# EAGLE design chandelier (EAGLE 6.4)
DATABASE: ../../control-surface/pcb/partsdb.txt
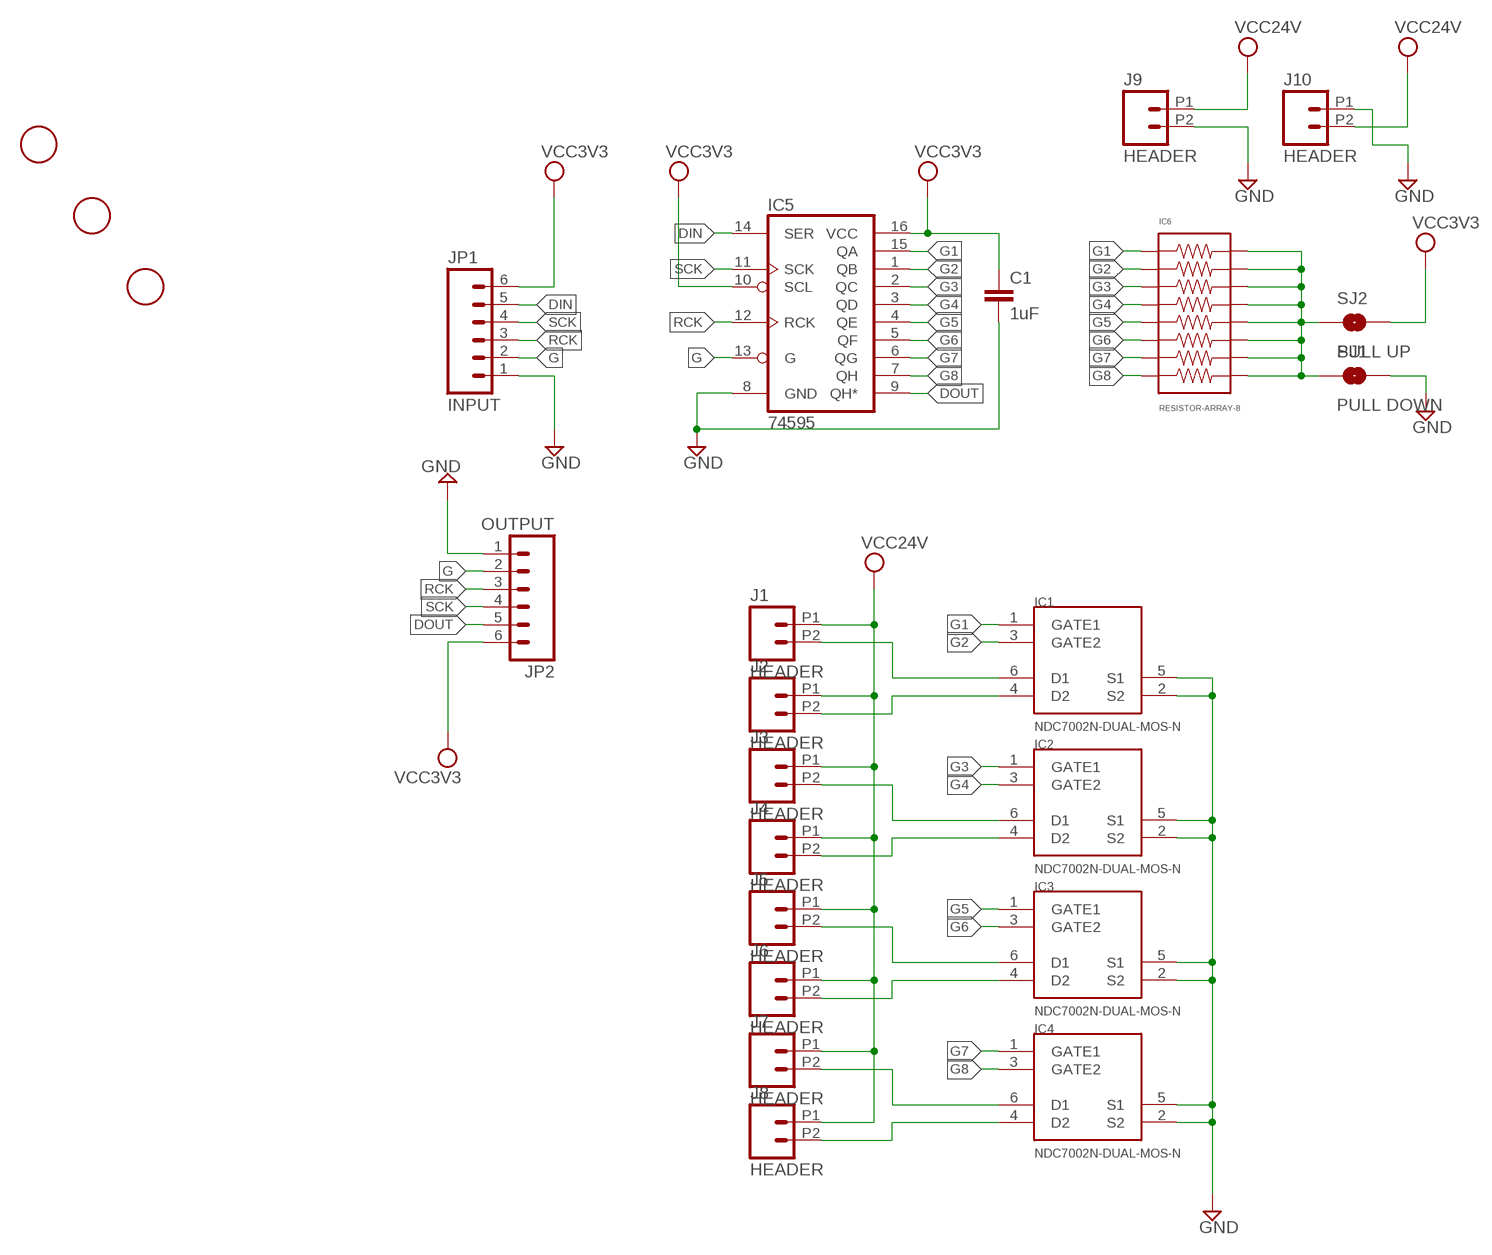
[diagram p0: schematic, sheet 1]

## Parts
C1  1uF  CAP0805  [0805]
IC1  NDC7002N-DUAL-MOS-N  [SSOT6]
IC2  NDC7002N-DUAL-MOS-N  [SSOT6]
IC3  NDC7002N-DUAL-MOS-N  [SSOT6]
IC4  NDC7002N-DUAL-MOS-N  [SSOT6]
IC5  74595  [TSSOP16]
IC6  RESISTOR-ARRAY-8  [CAY16-103J8]
J1  HEADER  [1X02-5.08-SCREWTERM]
J2  HEADER  [1X02-5.08-SCREWTERM]
J3  HEADER  [1X02-5.08-SCREWTERM]
J4  HEADER  [1X02-5.08-SCREWTERM]
J5  HEADER  [1X02-5.08-SCREWTERM]
J6  HEADER  [1X02-5.08-SCREWTERM]
J7  HEADER  [1X02-5.08-SCREWTERM]
J8  HEADER  [1X02-5.08-SCREWTERM]
J9  HEADER  [1X02-5.08-SCREWTERM]
J10  HEADER  [1X02-5.08-SCREWTERM]
JP1  INPUT  M06SIP_LOCK  [1X06-SIP_LOCK]
JP2  OUTPUT  M06SIP_LOCK  [1X06-SIP_LOCK]
SJ1  PULL DOWN  SOLDERJUMPERTRACE  [SJ_2S-TRACE]
SJ2  PULL UP  SOLDERJUMPERNO  [SJ_2S-NO]
U$1  FIDUCIAL  [FIDUCIAL_1MM]
U$4  FIDUCIAL  [FIDUCIAL_1MM]
U$5  FIDUCIAL  [FIDUCIAL_1MM]

## Nets
DIN: IC5.14(SER) JP1.5
DOUT: IC5.9(QH*) JP2.5
G: IC5.13(G) JP1.2 JP2.2
G1: IC1.1(GATE1) IC5.15(QA) IC6.2
G2: IC1.3(GATE2) IC5.1(QB) IC6.4
G3: IC2.1(GATE1) IC5.2(QC) IC6.6
G4: IC2.3(GATE2) IC5.3(QD) IC6.8
G5: IC3.1(GATE1) IC5.4(QE) IC6.10
G6: IC3.3(GATE2) IC5.5(QF) IC6.12
G7: IC4.1(GATE1) IC5.6(QG) IC6.14
G8: IC4.3(GATE2) IC5.7(QH) IC6.16
GND [power]: C1.2 IC1.2(S2) IC1.5(S1) IC2.2(S2) IC2.5(S1) IC3.2(S2) IC3.5(S1) IC4.2(S2) IC4.5(S1) IC5.8(GND) J9.P2 J10.P1 JP1.1 JP2.1 SJ1.2
N$1 [power]: IC1.6(D1) J1.P2
N$2 [power]: IC1.4(D2) J2.P2
N$3 [power]: IC2.6(D1) J3.P2
N$4 [power]: IC2.4(D2) J4.P2
N$5 [power]: IC3.6(D1) J5.P2
N$6 [power]: IC3.4(D2) J6.P2
N$7 [power]: IC4.6(D1) J7.P2
N$8 [power]: IC4.4(D2) J8.P2
N$9: IC6.1 IC6.3 IC6.5 IC6.7 IC6.9 IC6.11 IC6.13 IC6.15 SJ1.1 SJ2.1
RCK: IC5.12(RCK) JP1.3 JP2.3
SCK: IC5.11(SCK) JP1.4 JP2.4
VCC3V3: C1.1 IC5.10(SCL) IC5.16(VCC) JP1.6 JP2.6 SJ2.2
VCC24V [power]: J1.P1 J2.P1 J3.P1 J4.P1 J5.P1 J6.P1 J7.P1 J8.P1 J9.P1 J10.P2

## Library data of the parts
C1 = SparkFun-Capacitors:CAP: Capacitor Standard 0603 ceramic capacitor, and 0.1" leaded capacitor.; PARTNO: CL21B105KOFNNNE
IC1-IC4 = Livestream:NDC7002N-DUAL-MOS-N; PARTNO: NDC7002N
IC5 = SparkFun-DigitalIC:74*595: 8-bit SHIFT REGISTER, output latch; PARTNO: 74VHC595MTCX
IC6 = Livestream:RESISTOR-ARRAY-8; PARTNO: CAY16-103J8LF
J1-J10 = Livestream:HEADER
JP1 JP2 = SparkFun-Connectors:M06: Header 6 Standard 6-pin 0.1" header. Use with straight break away headers (SKU : PRT-00116), right angle break away headers (PRT-00553), swiss pins (PRT-00743), machine pins (PRT-00117), and female headers (PRT-00115). Molex polarized connector foot print use with SKU : PRT-08094 with associated crimp pins and housings. NOTES ON THE VARIANTS LOCK and LOCK_LONGPADS... This footprint was designed to help hold the alignment of a through-hole component (i.e. 6-pin header) while soldering it into place. You may notice that each hole has been shifted either up or down by 0.005 of an inch from it's more standard position (which is a perfectly straight line). This slight alteration caused the pins (the squares in the middle) to touch the edges of the holes. Because they are alternating, it causes a "brace" to hold the component in place. 0.005 has proven to be the perfect amount of "off-center" position when using our standard breakaway headers. Although looks a little odd when you look at the bare footprint, once you have a header in there, the alteration is very hard to notice. Also,if you push a header all the way into place, it is covered up entirely on the bottom side. This idea of altering the position of holes to aid alignment will be further integrated into the Sparkfun Library for other footprints. It can help hold any component with 3 or more connection pins.
SJ1 SJ2 = SparkFun-Passives:SOLDERJUMPER: Solder Jumper Standard SMD solder jumper. Used to automate production. Two varients : Normally Open and Normally Closed are the same, but have different paste layers. NC will have a large amount of paste and should jumper during reflow.
U$1 U$4 U$5 = adafruit:FIDUCIAL: For use by pick and place machines to calibrate the vision/machine, 1mm By microbuilder.eu

## Net classes
0 default: width 0.152 mm, drill 0.381 mm, clearance 0.152 mm
1 power: width 0.254 mm, drill 0.381 mm, clearance 0.152 mm

## Board
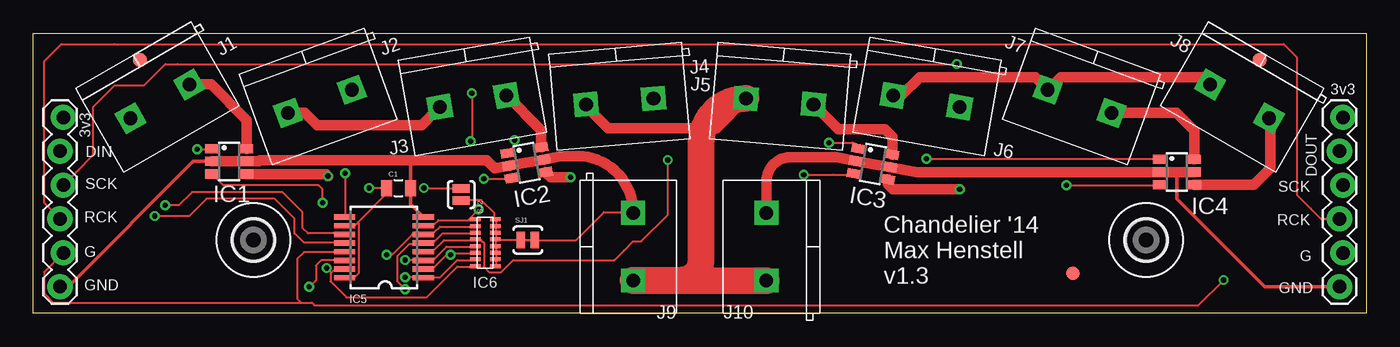
[diagram p1: board, top side]
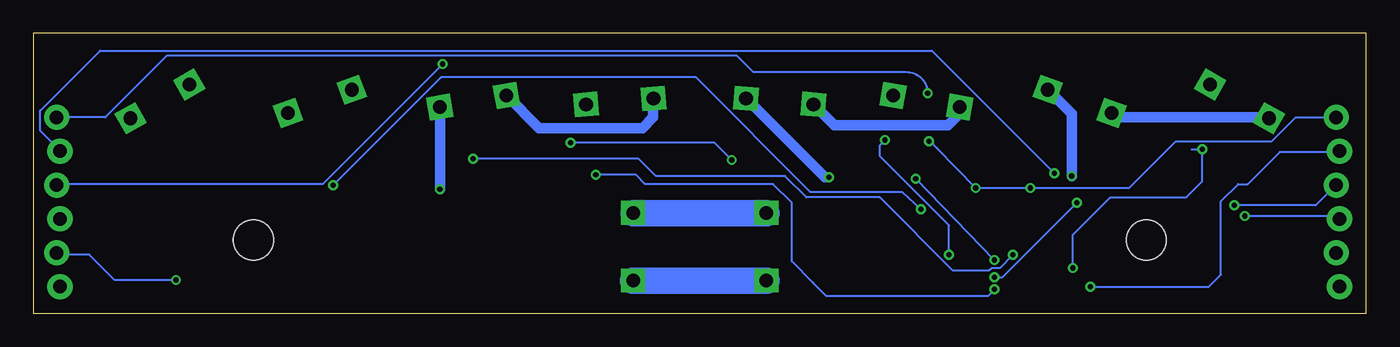
[diagram p2: board, bottom side, seen from below]

Size 100 x 21 mm. Coordinates in mm from the lower left corner, seen from the top.
Outline: 100,21 100,0 0,0 0,21 100,21
Copper layers (1*16): Top 0.0356mm / dielectric 1.5011mm / Bottom 0.0356mm
Design rules "oshpark *": minimum track width 6mil, minimum drill 13mil, track to track 6mil, track to pad 6mil, pad to pad 6mil, via to via 6mil, smd to smd 6mil, copper to edge 15mil, drill to drill 6mil, minimum pad ring 7mil, minimum via ring 7mil, stop-mask expansion 3mil, vias tented up to drill 15mil, thermal gap 10mil

### Footprints (pad centres in the part's own frame; a part is rotated, then mirrored left to right if it is on the bottom)
0805 = smd 0.8 x 1.2: 1 -0.9,0; 2 0.9,0
SSOT6 = smd 0.69 x 0.99: 1 -0.95,-1.3; 2 0,-1.3; 3 0.95,-1.3; 4 0.95,1.3; 5 0,1.3; 6 -0.95,1.3
TSSOP16 = smd 0.4 x 1.6: 1 -2.225,-2.85; 2 -1.575,-2.85; 3 -0.925,-2.85; 4 -0.275,-2.85; 5 0.375,-2.85; 6 1.025,-2.85; 7 1.675,-2.85; 8 2.325,-2.85; 9 2.325,3.05; 10 1.675,3.05; 11 1.025,3.05; 12 0.375,3.05; 13 -0.275,3.05; 14 -0.925,3.05; 15 -1.575,3.05; 16 -2.225,3.05
CAY16-103J8 = smd 0.3 x 0.8: 1 -1.75,-0.75; 2 -1.75,0.75; 3 -1.25,-0.75; 4 -1.25,0.75; 5 -0.75,-0.75; 6 -0.75,0.75; 7 -0.25,-0.75; 8 -0.25,0.75; 9 0.25,-0.75; 10 0.25,0.75; 11 0.75,-0.75; 12 0.75,0.75; 13 1.25,-0.75; 14 1.25,0.75; 15 1.75,-0.75; 16 1.75,0.75
1X02-5.08-SCREWTERM = drill 1.016 pad 1.778 square: P1 -2.54,0; P2 2.54,0
1X06-SIP_LOCK = drill 1.016 pad 1.88: 1 0,0; 2 2.54,-0.254; 3 5.08,0; 4 7.62,-0.254; 5 10.16,0; 6 12.7,-0.254
SJ_2S-TRACE = smd 0.635 x 1.27: 1 -0.508,0; 2 0.508,0
SJ_2S-NO = smd 0.635 x 1.27: 1 -0.45,0; 2 0.45,0
FIDUCIAL_1MM = smd 1 x 1: 1 0,0
HOLE-3 = hole 3: 0,0

### Placement (x,y rotation side)
C1  27.4,9.4 0 top
IC1  14.7,11.4 270 top
IC2  37,11.3 280 top
IC3  63,11.2 260 top
IC4  85.8,10.6 270 top
IC5  26.4,4.9 90 top
IC6  33.9,5.3 90 top
J1  9.5,15.9 30 top
J2  21.5,15.9 20 top
J3  33,15.9 10 top
J4  44,15.9 5 top
J5  56,15.9 355 top
J6  67,15.9 350 top
J7  78.5,15.9 340 top
J8  90.5,15.9 330 top
J9  45,5 90 top
J10  55,5 270 top
JP1  2,2 90 top
JP2  98,2 90 top
SJ1  37.1,5.5 0 top
SJ2  32.1,8.9 90 top
U$1  8,19 0 top
U$2  [HOLE-3]  83.5,5.5 0 top
U$3  [HOLE-3]  16.5,5.5 0 top
U$4  92,19 0 top
U$5  78,3 0 top

### Tracks (layer width: path | path; a pad name or v marks a point on that pad's centre or on a via)
DIN  (via drill 0.38)
  Top 0.152: IC5.14 23.3,4 21.6,4 21.2,3.6 21.2,2.5 v20.7,2
  Bottom 0.152: JP1.5 2,12.1 6.5,12.1 8.9,9.7 9.6,9.7 10.9,8.4 10.9,2.9 11.8,2 v20.7,2
DOUT  (via drill 0.38)
  Top 0.152: v23.4,10.5 23.4,7.3 IC5.9
  Bottom 0.152: v23.4,10.5 32.6,19.7 95,19.7 99.5,15.2 99.5,13.7 98,12.2 JP2.5
G  (via drill 0.38)
  Top 0.152: 20.1,0.8 1.5,0.8 0.8,1.5 0.8,3.1 2.2,4.5 JP1.2 | 20.1,0.8 20.9,0.8 21.1,0.6 36.3,0.6 87.4,0.6 v89.3,2.5 | IC5.13 23.3,4.6 20.3,4.6 19.8,4.1 19.8,1.1 20.1,0.8
  Bottom 0.152: 98.2,4.5 JP2.2 98.11,4.4 95.8,4.4 93.9,2.5 v89.3,2.5
G1  (via drill 0.38)
  Top 0.152: 22.35,3.05 22.6,3.3 23.3,3.3 IC5.15 | 22.35,3.05 22.3,3 22.3,2.4 23.5,1.2 29.5,1.2 31.8,3.5 33.1,3.5 IC6.2 | v12.3,12.3 13.4,12.3 IC1.1 | 22.35,3.05 v22,3.4
  Bottom 0.152: 13.1,12.3 v12.3,12.3 12.3,9.9 13.5,8.7 19.2,8.7 22,5.9 v22,3.4
G2  (via drill 0.38)
  Top 0.152: IC6.4 33.1,4 31.8,4 30.5,2.7 29.3,2.7 IC5.1 29.2,2.7 v27.9,2.7 | 13.4,10.4 IC1.3 14.25,9.6 21.4,9.6 21.7,9.3 v21.7,8.3
  Bottom 0.152: v21.7,8.3 27.3,2.7 v27.9,2.7
G3  (via drill 0.38)
  Top 0.152: 31.3,4.5 31.1,4.5 30,3.4 29.3,3.4 IC5.2 | 31.3,4.5 33.1,4.5 IC6.6 | 31.3,4.5 v31.3,4.4 | 35.6,12 IC2.1 36.1,12.55 v36.1,13
  Bottom 0.152: v31.3,4.4 31.3,6.6 36.5,11.8 36.5,12.6 v36.1,13
G4  (via drill 0.38)
  Top 0.152: IC6.8 33.1,5 31,5 30,4 29.3,4 IC5.3 29.2,4 v27.9,4 | v33.8,10.1 35.8,10.1 IC2.3
  Bottom 0.152: v27.9,4 v33.8,10.1
G5  (via drill 0.38)
  Top 0.152: IC5.4 29.3,4.7 30,4.7 30.8,5.5 33.1,5.5 IC6.10 33.2,5.5 33.6,5.5 33.8,5.3 33.8,3.5 34.2,3.1 35.1,3.1 36,4 43.6,4 44.3,4.7 45,5.4 45.6,5.4 47.6,7.4 v47.6,11.5 | v59.7,12.8 61.45,12.8 arc-90 IC3.1
  Bottom 0.152: v47.6,11.5 48.9,12.8 v59.7,12.8
G6  (via drill 0.38)
  Top 0.152: IC6.12 33.1,6 30.7,6 30,5.3 29.3,5.3 IC5.5 29.2,5.2 28.2,5.2 27.3,4.3 27.3,2.4 v27.9,1.8 | IC3.3 61.5,10.4 60,10.4 v57.8,10.4
  Bottom 0.152: v27.9,1.8 28.4,1.3 40.5,1.3 41.5,2.3 43.1,3.9 43.1,8.3 44.5,9.7 54.1,9.7 54.8,10.4 v57.8,10.4
G7  (via drill 0.38)
  Top 0.152: IC6.14 33.1,6.5 30.5,6.5 30,6 29.3,6 IC5.6 29.2,5.9 28.4,5.9 26.9,4.4 v26.5,4.4 | v67,11.6 84.5,11.6 IC4.1
  Bottom 0.152: v67,11.6 61.1,11.6 54.6,11.6 53.3,10.3 43.6,10.3 42,8.7 36.5,8.7 31,3.2 28.3,3.2 28.1,3.4 27.5,3.4 v26.5,4.4
G8  (via drill 0.38)
  Top 0.152: 32.6,7 30.4,7 30,6.6 29.3,6.6 IC5.7 | 32.6,7 33.1,7 IC6.16 | v77.5,9.6 84.4,9.6 IC4.3 | 32.6,7 v33.4,7.8
  Bottom 0.152: v77.5,9.6 69.4,17.7 50.3,17.7 41.7,9.1 34.8,9.1 v33.4,7.8
GND
  Top 0.152: SJ1.2 40.7,5.5 42.8,7.6 44.94,7.6 arc-90 J9.P2
  Top 0.254: JP2.1 93.5,2 92.4,2 85.8,8.6 85.8,10.6 | 61.8,11.4 IC3.2 | 64.2,10.9 IC3.5 | 35.8,11.1 IC2.2 35.6,11.1 | 29.3,7.3 IC5.8 29.2,7.3 28.3,8.2 C1.2 28.3,9.5 28.3,11.4 28.2,11.5 | JP1.1 2.6,2 12,11.4 IC1.2 | J9.P2 45,7.6
  Top 0.781: IC2.2 34.6,10.9 34,11.5 28.2,11.5 17,11.5 16.9,11.4 IC1.5 IC1.2 | 35.8,11.1 IC2.5 39.5,11.8 40.8,11.8 arc-90 45,7.6 | J10.P1 55,9.9 arc-90 56.8,11.7 60.3,11.7 61.8,11.4 IC3.5 66.3,10.6 IC4.2 85.8,10.6 IC4.5
  Bottom 0.254: 45,7.5 J9.P2 | 54.96,7.5 J10.P1
  Bottom 2: 45,7.5 54.96,7.5
N$1
  Top 0.781: J1.P2 13.33,17.17 16,14.5 IC1.6
N$2  (via drill 0.38)
  Top 0.781: IC1.4 21.95,10.45 v22.1,10.3
  Bottom 0.781: v22.1,10.3 22.1,14.98 J2.P2
N$3
  Top 0.781: J3.P2 38.1,13.74 38.1,12.5 38.1,12.48 IC2.6
N$4  (via drill 0.38)
  Top 0.781: IC2.4 38.45,10.55 38.8,10.2 v40.3,10.2
  Bottom 0.781: v40.3,10.2 40.61,10.2 J4.P2
N$5
  Top 0.781: IC3.6 64.44,13.26 63.9,13.8 60.41,13.8 J5.P2
N$6  (via drill 0.38)
  Top 0.781: IC3.4 64.11,9.69 64.5,9.3 v69.5,9.3
  Bottom 0.781: v69.5,9.3 J6.P2
N$7
  Top 0.781: J7.P2 85.77,15.03 87.1,13.7 IC4.6
N$8
  Top 0.781: IC4.4 91.55,9.65 92.8,10.9 92.8,14.53 J8.P2
N$9
  Top 0.152: IC6.9 34.7,5.6 34.7,6 IC6.11 34.7,6.1 34.7,6.5 IC6.13 34.7,6.6 34.7,7 IC6.15 34.6,7.1 34.6,7.5 33.6,8.5 32.5,8.5 SJ2.1 | IC6.1 34.7,3.6 34.7,4 IC6.3 34.7,4.1 34.7,4.5 IC6.5 34.7,4.6 34.7,5 IC6.7 34.7,5.1 34.7,5.5 IC6.9 | SJ1.1 34.65,5.5 IC6.9
RCK  (via drill 0.38)
  Top 0.152: IC5.12 23.3,5.3 20.3,5.3 19.6,6 19.6,7.1 18.1,8.6 13,8.6 11.7,7.3 v9.1,7.3 | JP1.3 2,7.1 0.8,8.3 0.8,14.9 0.8,18.9 2.1,20.2 6.1,20.2 89.1,20.2 93.8,20.2 94.8,19.2 94.8,8.9 95.85,7.85 96.6,7.1 97.98,7.1 JP2.3
  Bottom 0.152: v9.1,7.3 2.4,7.3 2,7.1 JP1.3
SCK  (via drill 0.38)
  Top 0.152: IC5.11 23.3,6 20.6,6 20.2,6.4 20.2,7.6 18.7,9.1 11.9,9.1 10.9,8.1 v9.9,8.1 | v69.3,18.7 10.8,18.7 9.9,18.7 8.3,17.1 6.1,17.1 4.5,15.5 4.5,11.9 3.2,10.6 2.3,9.7 JP1.4
  Bottom 0.152: v9.9,8.1 3.8,8.1 2.3,9.6 JP1.4 | v69.3,18.7 78.3,9.7 98.2,9.7 JP2.4
VCC3V3  (via drill 0.38)
  Top 0.152: 24.35,6.85 24.1,6.6 23.4,6.6 IC5.10 | 24.35,6.85 26.5,9 C1.1 v25.2,9.4 | v29.3,9.4 32.4,9.4 SJ2.2 | IC5.16 23.4,2.7 24.1,2.7 24.4,3 24.4,6.8 24.35,6.85 | v32.9,16.5 32.9,13 v32.8,12.9
  Bottom 0.152: JP1.6 5.3,14.7 7.1,12.9 14.3,12.9 17.8,9.4 v25.2,9.4 v29.3,9.4 32.2,12.4 32.7,12.9 v32.8,12.9 | JP2.6 94.6,14.7 90,19.3 47.2,19.3 46,18.1 35.9,18.1 34.5,18.1 arc90 v32.9,16.5
VCC24V
  Top 0.254: 52.1,14.8 53.4,16.1 J5.P1
  Top 0.781: J2.P1 20.37,15.03 21.3,14.1 29.14,14.1 J3.P1 | J4.P1 41.47,15.53 43.1,13.9 51.25,13.9 J5.P1 | J6.P1 65.14,16.34 66.5,17.7 75.18,17.7 J7.P1 76.17,16.77 77.1,17.7 87.77,17.7 J8.P1
  Top 2: J10.P2 45.04,2.46 45,2.5 48.6,2.5 arc90 50.1,4 50.1,12.75 arc-90 J5.P1
  Bottom 0.254: 53.5,16.1 J5.P1 | 7.4,14.7 7.37,14.7 J1.P1
  Bottom 0.781: 7.4,14.7 19.11,14.7 J2.P1 | J3.P1 30.5,15 31.4,14.1 39.89,14.1 J4.P1 | 53.5,16.1 53.5,14.7 54.3,13.9 62.06,13.9 J6.P1
  Bottom 2: J9.P1 J10.P2

### Text on the board
tPlace: 3v3 | DOUT | 3v3 | DIN | SCK | SCK | RCK | RCK | G | G | GND | Chandelier '14 / Max Henstell / v1.3 | GND